# Altium project LED_DRIVER_80W.PrjPcb
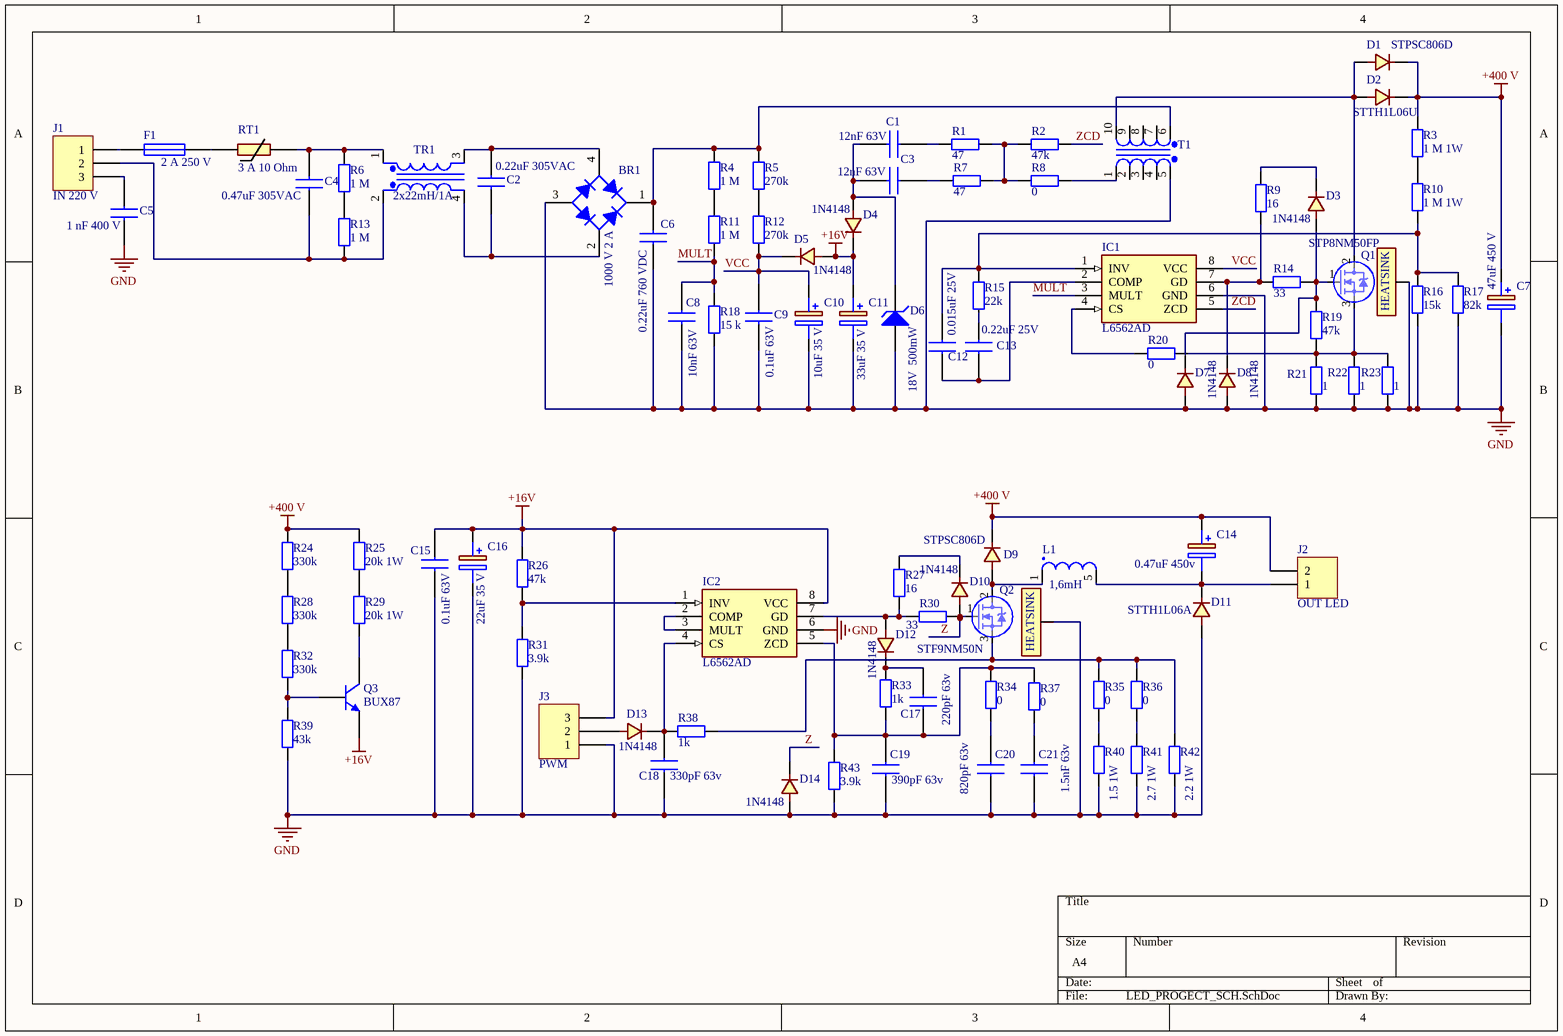
[diagram p0: LED_PROGECT_SCH.SchDoc]
1 sheet, 94 parts. Net scope: global (net labels, ports and power ports of the same name join across sheets).
Board file: LED_PROGECT_BOARD.PcbDoc

## Sheet LED_PROGECT_SCH.SchDoc
size A4

### Parts
BR1  1000 V 2 A  [SOPA-4]
C1  12nF 63V  [Cap1206]
C2  0.22uF 305VAC  [CAP32229]
C3  12nF 63V  [Cap1206]
C4  0.47uF 305VAC  [CAP32229]
C5  1 nF 400 V  [Capacitor radial]
C6  0.22uF 760 VDC  [CAP32229]
C7  47uF 450 V  [CAP ALUMINIUM 16 mm 1]
C8  10nF 63V  [Cap1206]
C9  0.1uF 63V  [Cap1206]
C10  10uF 35 V  [CAP ALUM 5mm]
C11  33uF 35 V  [CAP ALUM 5mm]
C12  0.015uF 25V  [Cap1206]
C13  0.22uF 25V  [Cap1206]
C14  0.47uF 450v  [Cap aluminium 12.5x5]
C15  0.1uF 63V  [Cap1206]
C16  22uF 35 V  [CAP ALUM 5mm]
C17  220pF 63v  [CAP0805]
C18  330pF 63v  [Cap1206]
C19  390pF 63v  [Cap1206]
C20  820pF 63v  [Cap1206]
C21  1.5nF 63v  [Cap1206]
D1  STPSC806D  [TO220 DOIDE]
D2  STTH1L06U  [SMB]
D3  1N4148  [SOD123]
D4  1N4148  [SOD123]
D5  1N4148  [SOD123]
D6  18V  500mW  [SOD123]
D7  1N4148  [SOD123]
D8  1N4148  [SOD123]
D9  STPSC806D  [TO220 DOIDE]
D10  1N4148  [SOD123]
D11  STTH1L06A  [SMA]
D12  1N4148  [SOD123]
D13  1N4148  [SOD123]
D14  1N4148  [SOD123]
F1  2 A 250 V  [FUSE SMD]
H1  HEATSINK  [HEATSINK]  (value not drawn)
H2  HEATSINK  [HEATSINK]  (value not drawn)
IC1  L6562AD  [SOIC127P600X175-8N]
IC2  L6562AD  [SOIC127P600X175-8N]
J1  IN 220 V  [PIN3 TERMINAL]
J2  OUT LED  [TERMINAL 2 PIN]
J3  PWM  [PIN3 TERMINAL]
L1  1,6mH  [INDUCTOR E25/13/7]
Q1  STP8NM50FP  [TO220]
Q2  STF9NM50N  [TO220]
Q3  BUX87  [SOT32]
R1  47  [RES1206]
R2  47k  [RES1206]
R3  1 M 1W  [AXIAL-0.6]
R4  1 M  [RES1206]
R5  270k  [RES1206]
R6  1 M  [RES1206]
R7  47  [RES1206]
R8  0  [RES1206]
R9  16  [RES1206]
R10  1 M 1W  [AXIAL-0.6]
R11  1 M  [RES1206]
R12  270k  [RES1206]
R13  1 M  [RES1206]
R14  33  [RES1206]
R15  22k  [RES1206]
R16  15k  [RES1206]
R17  82k  [RES1206]
R18  15 k  [RES1206]
R19  47k  [RES1206]
R20  0  [RES1206]
R21  1  [RES1206]
R22  1  [RES1206]
R23  1  [RES1206]
R24  330k  [RES1206]
R25  20k 1W  [AXIAL-0.6]
R26  47k  [RES1206]
R27  16  [RES1206]
R28  330k  [RES1206]
R29  20k 1W  [AXIAL-0.6]
R30  33  [RES1206]
R31  3.9k  [RES1206]
R32  330k  [RES1206]
R33  1k  [RES1206]
R34  0  [RES1206]
R35  0  [RES1206]
R36  0  [RES1206]
R37  0  [RES1206]
R38  1k  [RES1206]
R39  43k  [RES1206]
R40  1.5 1W  [AXIAL-0.6]
R41  2.7 1W  [AXIAL-0.6]
R42  2.2 1W  [AXIAL-0.6]
R43  3.9k  [RES1206]
RT1  3 A 10 Ohm  [NTC]
T1  Trans E25/13/7  [TRANS E25/13/7]  (value not drawn)
TR1  2x22mH/1A  [CHOKE IND]

### Nets
+16V: C11.1(+) C15.2 C16.1(+) D4.2 D5.1 IC2.8(VCC) J3.3 Q3.1(E) R26.2
+400 V: C7.1 C14.1(+) D1.1 D2.2 D9.1 J2.2 R3.2 R24.2 R25.2
GND: BR1.3(A) C5.1 C6.1 C7.2 C8.1 C9.1 C10.2(-) C11.2(-) C15.1 C16.2(-) C18.1 C19.1 C20.1 C21.1 D6.1(A) D7.1 D8.1 D11.1 D14.1 H1.1(C) H2.1(C) IC1.6(GND) IC2.6(GND) J3.1 R16.2 R17.2 R18.1 R21.1 R22.1 R23.1 R31.1 R39.1 R40.1 R41.1 R42.1 R43.2 T1.5
MULT: C8.2 IC1.3(MULT) R11.1 R18.2
VCC: C9.2 C10.1(+) D5.2 IC1.8(VCC) R12.1
Z: D10.1 D14.2 Q2.1(G) R30.1
ZCD: IC1.5(ZCD) R2.1
NetBR1_1: BR1.1(K) C6.2 R4.2 R5.2 T1.6
NetBR1_2: BR1.2(C) C2.1 TR1.4(Pri-)
NetBR1_4: BR1.4(C) C2.2 TR1.3(Sec-)
NetC1_1: C1.1 R1.2
NetC1_2: C1.2 C3.2 D4.1 D6.2(K)
NetC3_1: C3.1 R7.2
NetC4_1: C4.1 J1.2 R13.1 TR1.2(Pri+)
NetC4_2: C4.2 R6.2 RT1.2 TR1.1(Sec+)
NetC5_2: C5.2 J1.3
NetC12_1: C12.1 IC1.1(INV) R10.1 R15.1 R16.1 R17.1
NetC12_2: C12.2 C13.2 IC1.2(COMP)
NetC13_1: C13.1 R15.2
NetC14_2: C14.2(-) D11.2 J2.1 L1.5
NetC17_1: C17.1 C19.2 IC2.5(ZCD) R33.2 R34.1 R37.1 R43.1
NetC17_2: C17.2 D12.2 R33.1
NetC18_2: C18.2 D13.2 IC2.4(CS) R38.2
NetC20_2: C20.2 R34.2
NetC21_2: C21.2 R37.2
NetD1_2: D1.2 D2.1 Q1.2(D) T1.10
NetD3_1: D3.1 D7.2 Q1.1(G) R14.2 R19.2
NetD3_2: D3.2 R9.2
NetD8_2: D8.2 IC1.7(GD) R9.1 R14.1
NetD9_2: D9.2 L1.1 Q2.2(D)
NetD10_2: D10.2 R27.2
NetD12_1: D12.1 IC2.7(GD) R27.1 R30.2
NetD13_1: D13.1 J3.2
NetF1_1: F1.1 J1.1
NetF1_2: F1.2 RT1.1
NetIC1_4: IC1.4(CS) R20.2
NetIC2_1: IC2.1(INV) R26.1 R31.2
NetIC2_2: IC2.2(COMP) IC2.3(MULT)
NetQ1_3: Q1.3(S) R19.1 R20.1 R21.2 R22.2 R23.2
NetQ2_3: Q2.3(S) R35.1 R36.1 R38.1 R42.2
NetQ3_2: Q3.2(C) R29.1
NetQ3_3: Q3.3(B) R32.1 R39.2
NetR1_1: R1.1 R2.2 R7.1 R8.2
NetR3_1: R3.1 R10.2
NetR4_1: R4.1 R11.2
NetR5_1: R5.1 R12.2
NetR6_1: R6.1 R13.2
NetR8_1: R8.1 T1.1
NetR24_1: R24.1 R28.2
NetR25_1: R25.1 R29.2
NetR28_1: R28.1 R32.2
NetR35_2: R35.2 R40.2
NetR36_2: R36.2 R41.2

Not connected (* = marked no-connect by the designer): T1 2 3 4 7 8 9

### Library data of the parts
BR1 = Bridge1: Full Wave Diode Bridge; Published: 8-Jun-2000; LatestRevisionDate: 29-May-2009; LatestRevisionNote: Sch pins A & K swapped.; DatasheetVersion: E2732B; PackageReference: D-38; Publisher: Altium Limited; PackageDescription: Bridge Rectifier; 4 Terminals; Body 9.4 x 9.4 mm (typ); Pitch 5.08 mm
C1 C3 C8 C9 C12 C13 C15 C18-C21 = Capacotor 1206: Ceramic capacitor
C2 C4 C6 = Capacitor B32922: Capacitor film
C5 = Capacitor C911U102MVWDBA7317: Capacitor radial
C7 = CAP POLARIZES 16-31 mm: Cap polarized
C10 C11 C16 = CAP POLARIZES 5-2 mm: Cap polarized
C14 = ESMG451ELLR47MJC5S: Capacitpr polarized
C17 = Capacotor ceramic: Ceramic capacitor
D1 D9 = STPSC806D: 600 V, 5 A
D2 = STTH1L06U: 600 V 1 A
D3-D5 D7 D8 D10 D12-D14 = 1N4148: Diode
D6 = BZT52C18-7-F: Diode Zener
D11 = STTH1L06A: 600 V ,1 A
F1 = Fuse 1: Fuse; Published: 8-Jun-2000; LatestRevisionDate: 17-Jul-2002; LatestRevisionNote: Re-released for DXP Platform.; PackageReference: PIN-W2/E2.8; Publisher: Altium Limited; PackageDescription: Thru-Hole; 2 Leads
J1 J3 = PIN3 TERMINAL 5 mm
J2 = PIN 2 TERMINAL
L1 = INDUCTOR E25/13/7: INDUCTOR
Q1 Q2 = STD8NM50N: N-channel 500 V, 0.73 Ω typ., 5 A
Q3 = BUX87: NPN power transistor
R1 R2 R4-R9 R11-R24 R26-R28 R30-R39 R43 = RES1206: Resistor 1206
R3 R10 R25 R29 R40-R42 = Res 1W: Resistor; Published: 8-Jun-2000; LatestRevisionDate: 17-Jul-2002; LatestRevisionNote: Re-released for DXP Platform.; PackageReference: AXIAL-0.4; Publisher: Altium Limited; PackageDescription: Axial Device, Thru-Hole; 2 Leads; 0.4 in Pin Spacing
RT1 = B57235S0100M051: Thermistor; Manufacturer_Name: EPCOS; Datasheet Link: https://product.tdk.com/info/en/documents/data_sheet/50/db/icl_16/S235.pdf; Height: 14mm; Manufacturer_Part_Number: B57235S0100M051; Mouser Part Number: 871-B57235S0100M051; Mouser Price/Stock: https://www.mouser.co.uk/ProductDetail/EPCOS-TDK/B57235S0100M051?qs=Uha62PnlbFC%2FoMpjFbtGuw%3D%3D
T1 = Trans E25/13/7: Center-Tapped Transformer (Coupled Inductor Model); Published: 8-Jun-2000; LatestRevisionDate: 17-Jul-2002; LatestRevisionNote: Re-released for DXP Platform.; PackageReference: TRF_5; Publisher: Altium Limited; PackageDescription: Transformer; 5 Leads
TR1 = CHOKES 22uH 1A: CHOKE